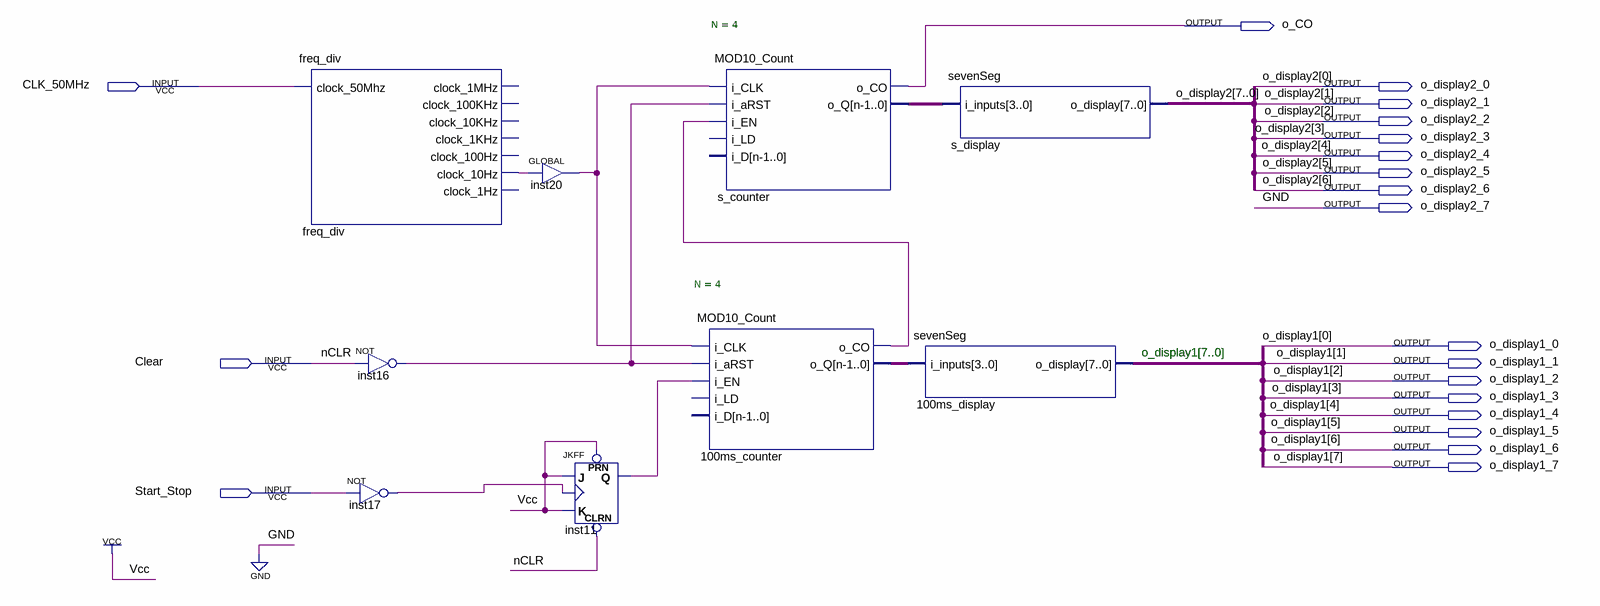
[diagram p0: schematic sheet]
// Quartus schematic stopwatch_sch.bdf as structural Verilog: 9 symbols, 20 pins
module stopwatch_sch (
  input  CLK_50MHz,
  input  Clear,
  input  Start_Stop,
  output o_CO,
  output o_display2_0,
  output o_display2_1,
  output o_display2_2,
  output o_display2_3,
  output o_display2_4,
  output o_display2_5,
  output o_display2_6,
  output o_display2_7,
  output o_display1_0,
  output o_display1_1,
  output o_display1_2,
  output o_display1_3,
  output o_display1_4,
  output o_display1_5,
  output o_display1_6,
  output o_display1_7
);

  wire freq_div_clock_10hz, inst11_q, inst16_out, inst17_out, inst20_out, n100ms_counter_o_co;
  wire [3:0] n100ms_counter_o_q, s_counter_o_q;
  wire [7:7] o_display2;

  freq_div freq_div (
    .clock_50Mhz(CLK_50MHz), .clock_10Hz(freq_div_clock_10hz));  // open: clock_1MHz, clock_100KHz, clock_10KHz, clock_1KHz, clock_100Hz, clock_1Hz
  not inst16 (inst16_out, Clear);
  not inst17 (inst17_out, Start_Stop);
  GLOBAL inst20 (.IN(freq_div_clock_10hz), .OUT(inst20_out));
  JKFF inst11 (.PRN(1'b1), .CLRN(Clear), .K(1'b1), .J(1'b1), .CLK(inst17_out), .Q(inst11_q));
  MOD10_Count #(.N(4)) u_100ms_counter (
    .i_CLK(inst20_out), .i_aRST(inst16_out), .i_EN(inst11_q), .o_CO(n100ms_counter_o_co),
    .o_Q(n100ms_counter_o_q));  // open: i_LD, i_D
  MOD10_Count #(.N(4)) s_counter (
    .i_CLK(inst20_out), .i_aRST(inst16_out), .i_EN(n100ms_counter_o_co), .o_CO(o_CO), .o_Q(s_counter_o_q));  // open: i_LD, i_D
  sevenSeg u_100ms_display (
    .i_inputs(n100ms_counter_o_q),
    .o_display({o_display1_7, o_display1_6, o_display1_5, o_display1_4, o_display1_3, o_display1_2, o_display1_1, o_display1_0}));
  sevenSeg s_display (
    .i_inputs(s_counter_o_q),
    .o_display({o_display2[7], o_display2_6, o_display2_5, o_display2_4, o_display2_3, o_display2_2, o_display2_1, o_display2_0}));

  assign o_display2_7 = 1'b0;

  // Other names for the same wires on the sheet: nCLR = Clear;
  //   o_display1[7:0] = {o_display1_7, o_display1_6, o_display1_5, o_display1_4, o_display1_3, o_display1_2, o_display1_1, o_display1_0};
  //   o_display2[6:0] = {o_display2_6, o_display2_5, o_display2_4, o_display2_3, o_display2_2, o_display2_1, o_display2_0}

  // Notes on the sheet:
  //   o_display1[7..0]
endmodule
